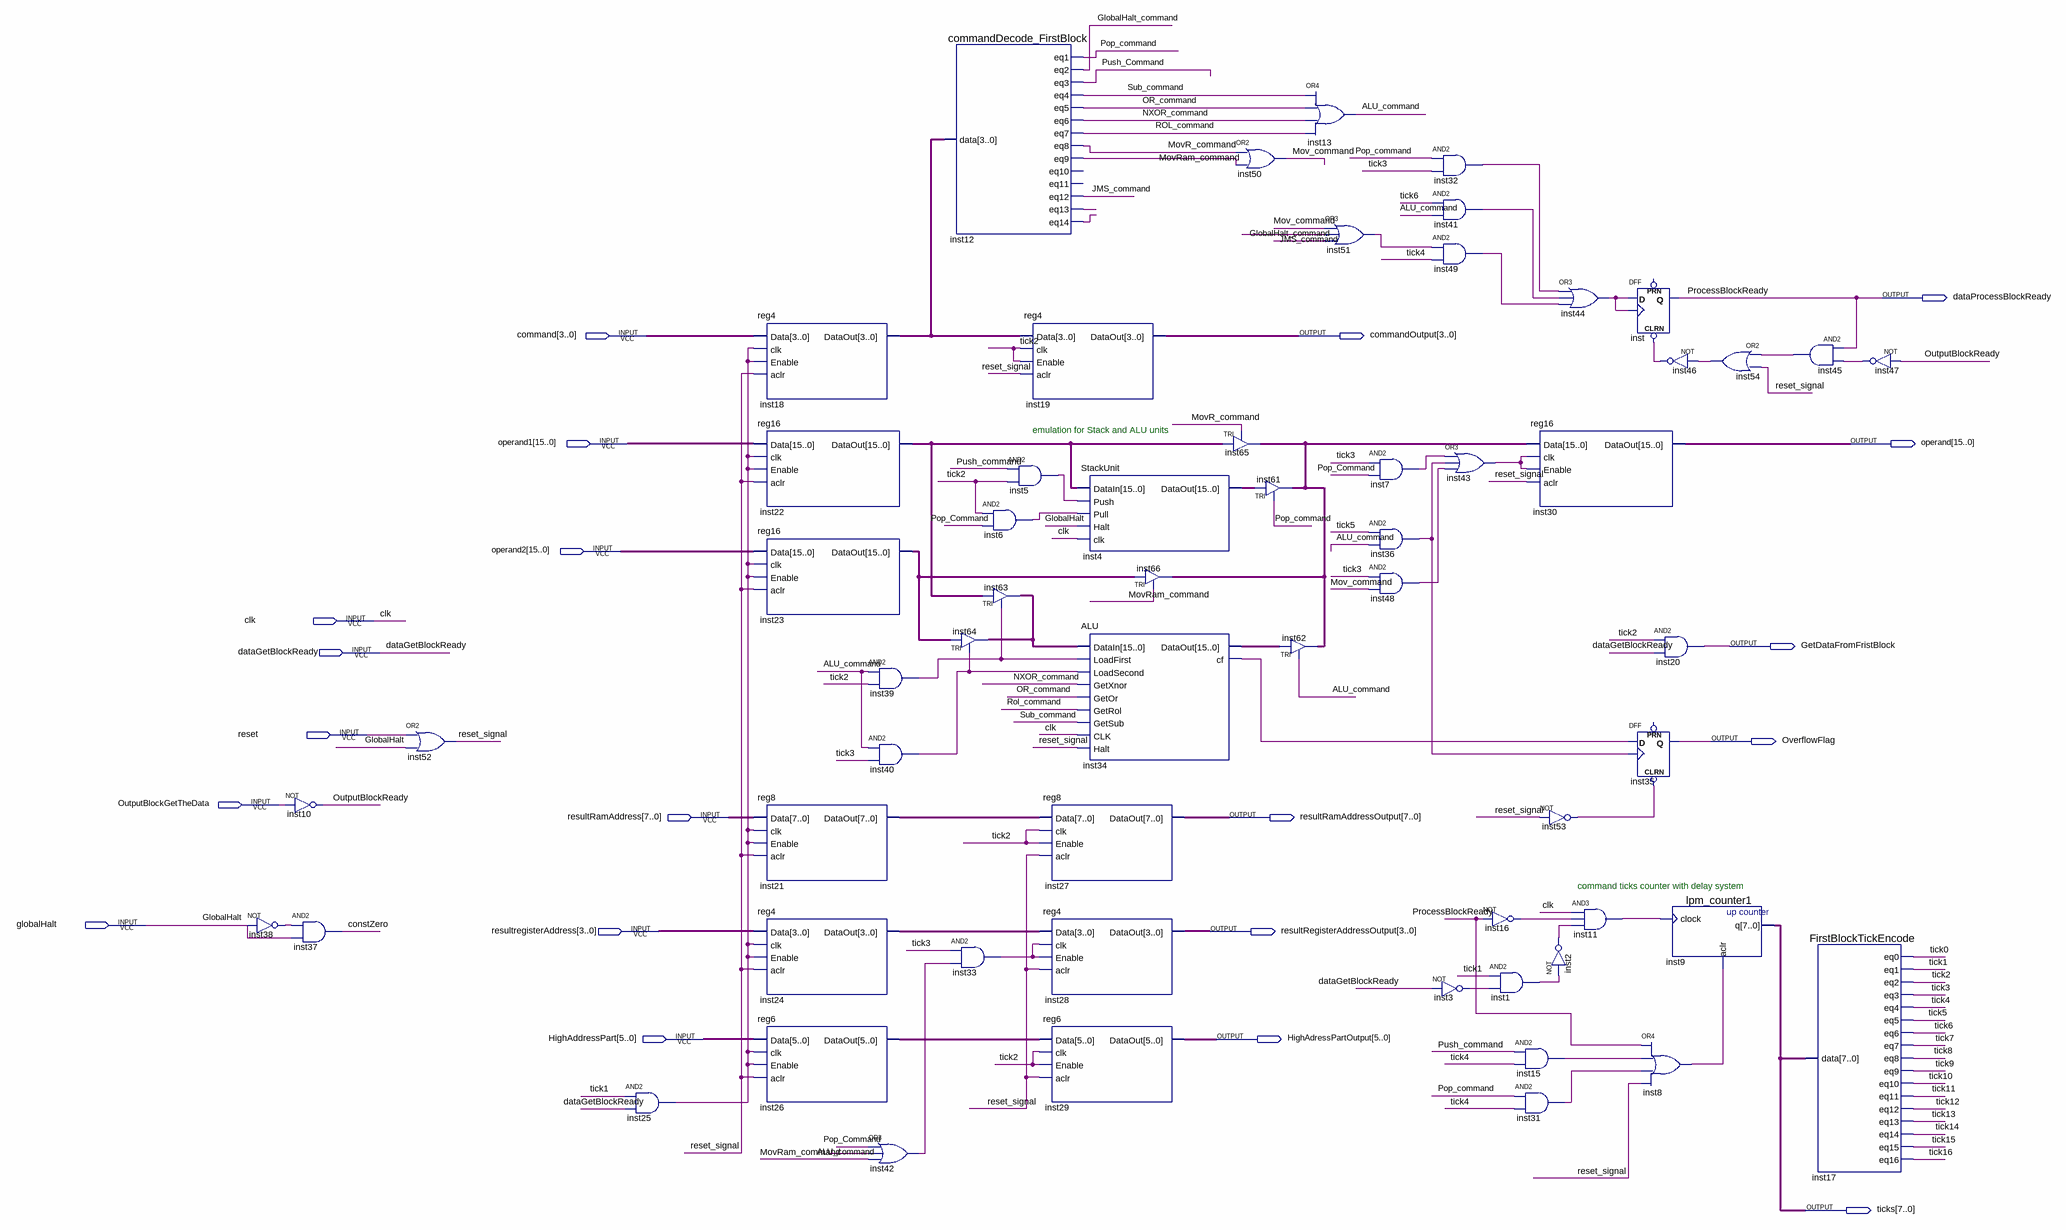
[diagram p0: schematic sheet]
// Quartus schematic DataProcessBlock.bdf as structural Verilog: 60 symbols, 20 pins
module DataProcessBlock (
  input  [3:0] command,
  input  [15:0] operand1,
  input  [15:0] operand2,
  input  clk,
  input  dataGetBlockReady,
  input  reset,
  input  OutputBlockGetTheData,
  input  [7:0] resultRamAddress,
  input  globalHalt,
  input  [3:0] resultregisterAddress,
  input  [5:0] HighAddressPart,
  output dataProcessBlockReady,
  output [3:0] commandOutput,
  output [15:0] operand,
  output GetDataFromFristBlock,
  output OverflowFlag,
  output [7:0] resultRamAddressOutput,
  output [3:0] resultRegisterAddressOutput,
  output [5:0] HighAdressPartOutput,
  output [7:0] ticks
);

  wire ALU_command, constZero, GlobalHalt_command, inst1_out, inst2_out, inst3_out, inst5_out, inst6_out,
       inst7_out, inst8_out, inst11_out, inst12_eq13, inst12_eq14, inst15_out, inst16_out, inst25_out,
       inst31_out, inst32_out, inst33_out, inst34_cf, inst36_out, inst38_out, inst39_out, inst40_out,
       inst41_out, inst42_out, inst43_out, inst44_out, inst45_out, inst46_out, inst47_out, inst48_out,
       inst49_out, inst51_out, inst53_out, inst54_out, JMS_command, Mov_command, MovR_command,
       MovRam_command, NXOR_command, OR_command, OutputBlockReady, Pop_command, Push_Command, reset_signal,
       ROL_command, Sub_command, tick0, tick1, tick2, tick3, tick4, tick5, tick6, tick7, tick8, tick9,
       tick10, tick11, tick12, tick13, tick14, tick15, tick16;
  wire [3:0] inst18_dataout, inst24_dataout;
  wire [5:0] inst26_dataout;
  wire [7:0] inst21_dataout;
  wire [15:0] inst4_dataout, inst22_dataout, inst23_dataout, inst34_dataout, inst63_out, inst66_out;

  not inst38 (inst38_out, globalHalt);
  not inst10 (OutputBlockReady, OutputBlockGetTheData);
  and inst37 (constZero, inst38_out, globalHalt);
  or inst52 (reset_signal, reset, globalHalt);
  and inst25 (inst25_out, tick1, dataGetBlockReady);
  reg4 inst18 (.Data(command), .clk(inst25_out), .Enable(inst25_out), .aclr(reset_signal), .DataOut(inst18_dataout));
  reg16 inst22 (.Data(operand1), .clk(inst25_out), .Enable(inst25_out), .aclr(reset_signal), .DataOut(inst22_dataout));
  reg16 inst23 (.Data(operand2), .clk(inst25_out), .Enable(inst25_out), .aclr(reset_signal), .DataOut(inst23_dataout));
  reg8 inst21 (
    .Data(resultRamAddress), .clk(inst25_out), .Enable(inst25_out), .aclr(reset_signal),
    .DataOut(inst21_dataout));
  reg4 inst24 (
    .Data(resultregisterAddress), .clk(inst25_out), .Enable(inst25_out), .aclr(reset_signal),
    .DataOut(inst24_dataout));
  reg6 inst26 (
    .Data(HighAddressPart), .clk(inst25_out), .Enable(inst25_out), .aclr(reset_signal),
    .DataOut(inst26_dataout));
  and inst39 (inst39_out, ALU_command, tick2);
  and inst40 (inst40_out, ALU_command, tick3);
  or inst42 (inst42_out, Pop_command, ALU_command, MovRam_command);
  commandDecode_FirstBlock inst12 (
    .data(inst18_dataout), .eq1(Pop_command), .eq2(GlobalHalt_command), .eq3(Push_Command),
    .eq4(Sub_command), .eq5(OR_command), .eq6(NXOR_command), .eq7(ROL_command), .eq8(MovR_command),
    .eq9(MovRam_command), .eq12(JMS_command), .eq13(inst12_eq13), .eq14(inst12_eq14));  // open: eq10, eq11
  and inst6 (inst6_out, tick2, Pop_command);
  TRI inst63[15:0] (.IN(inst22_dataout), .OE(inst39_out), .OUT(inst63_out));
  TRI inst64[15:0] (.IN(inst23_dataout), .OE(inst40_out), .OUT(inst63_out));
  and inst33 (inst33_out, tick3, inst42_out);
  reg4 inst19 (.Data(inst18_dataout), .clk(tick2), .Enable(tick2), .aclr(reset_signal), .DataOut(commandOutput));
  and inst5 (inst5_out, Push_Command, tick2);
  StackUnit inst4 (
    .DataIn(inst22_dataout), .Push(inst5_out), .Pull(inst6_out), .Halt(globalHalt), .clk(clk),
    .DataOut(inst4_dataout));
  ALU inst34 (
    .DataIn(inst63_out), .LoadFirst(inst39_out), .LoadSecond(inst40_out), .GetXnor(NXOR_command),
    .GetOr(OR_command), .GetRol(ROL_command), .GetSub(Sub_command), .CLK(clk), .Halt(reset_signal),
    .DataOut(inst34_dataout), .cf(inst34_cf));
  reg8 inst27 (
    .Data(inst21_dataout), .clk(tick2), .Enable(tick2), .aclr(reset_signal), .DataOut(resultRamAddressOutput));
  reg4 inst28 (
    .Data(inst24_dataout), .clk(inst33_out), .Enable(inst33_out), .aclr(reset_signal),
    .DataOut(resultRegisterAddressOutput));
  reg6 inst29 (.Data(inst26_dataout), .clk(tick2), .Enable(tick2), .aclr(reset_signal), .DataOut(HighAdressPartOutput));
  TRI inst66[15:0] (.IN(inst23_dataout), .OE(MovRam_command), .OUT(inst66_out));
  or inst50 (Mov_command, MovR_command, MovRam_command);
  TRI inst65[15:0] (.IN(inst22_dataout), .OE(MovR_command), .OUT(inst66_out));
  TRI inst61[15:0] (.IN(inst4_dataout), .OE(Pop_command), .OUT(inst66_out));
  TRI inst62[15:0] (.IN(inst34_dataout), .OE(ALU_command), .OUT(inst66_out));
  or inst13 (ALU_command, Sub_command, OR_command, NXOR_command, ROL_command);
  or inst51 (inst51_out, Mov_command, GlobalHalt_command, JMS_command);
  and inst7 (inst7_out, tick3, Pop_command);
  and inst36 (inst36_out, tick5, ALU_command);
  and inst48 (inst48_out, tick3, Mov_command);
  and inst32 (inst32_out, Pop_command, tick3);
  and inst41 (inst41_out, tick6, ALU_command);
  and inst49 (inst49_out, inst51_out, tick4);
  not inst3 (inst3_out, dataGetBlockReady);
  or inst43 (inst43_out, inst7_out, inst36_out, inst48_out);
  not inst16 (inst16_out, dataProcessBlockReady);
  and inst1 (inst1_out, tick1, inst3_out);
  reg16 inst30 (.Data(inst66_out), .clk(inst43_out), .Enable(inst43_out), .aclr(reset_signal), .DataOut(operand));
  not inst53 (inst53_out, reset_signal);
  and inst15 (inst15_out, Push_Command, tick4);
  and inst31 (inst31_out, Pop_command, tick4);
  or inst44 (inst44_out, inst32_out, inst41_out, inst49_out);
  and inst11 (inst11_out, clk, inst16_out, inst2_out);
  not inst2 (inst2_out, inst1_out);
  DFF inst (.CLRN(inst46_out), .CLK(inst44_out), .D(inst44_out), .Q(dataProcessBlockReady));  // open: PRN
  DFF inst35 (.CLRN(inst53_out), .CLK(inst36_out), .D(inst34_cf), .Q(OverflowFlag));  // open: PRN
  or inst8 (inst8_out, dataProcessBlockReady, inst15_out, inst31_out, reset_signal);
  not inst46 (inst46_out, inst54_out);
  and inst20 (GetDataFromFristBlock, tick2, dataGetBlockReady);
  lpm_counter1 inst9 (.clock(inst11_out), .aclr(inst8_out), .q(ticks));
  or inst54 (inst54_out, inst45_out, reset_signal);
  and inst45 (inst45_out, dataProcessBlockReady, inst47_out);
  FirstBlockTickEncode inst17 (
    .data(ticks), .eq0(tick0), .eq1(tick1), .eq2(tick2), .eq3(tick3), .eq4(tick4), .eq5(tick5), .eq6(tick6),
    .eq7(tick7), .eq8(tick8), .eq9(tick9), .eq10(tick10), .eq11(tick11), .eq12(tick12), .eq13(tick13),
    .eq14(tick14), .eq15(tick15), .eq16(tick16));
  not inst47 (inst47_out, OutputBlockReady);

  // Other names for the same wires on the sheet: ProcessBlockReady = dataProcessBlockReady

  // Notes on the sheet:
  //   emulation for Stack and ALU units
  //   command ticks counter with delay system
endmodule
